# Altium project STM32F373BluePill.PrjPcb (part 4 of 4)
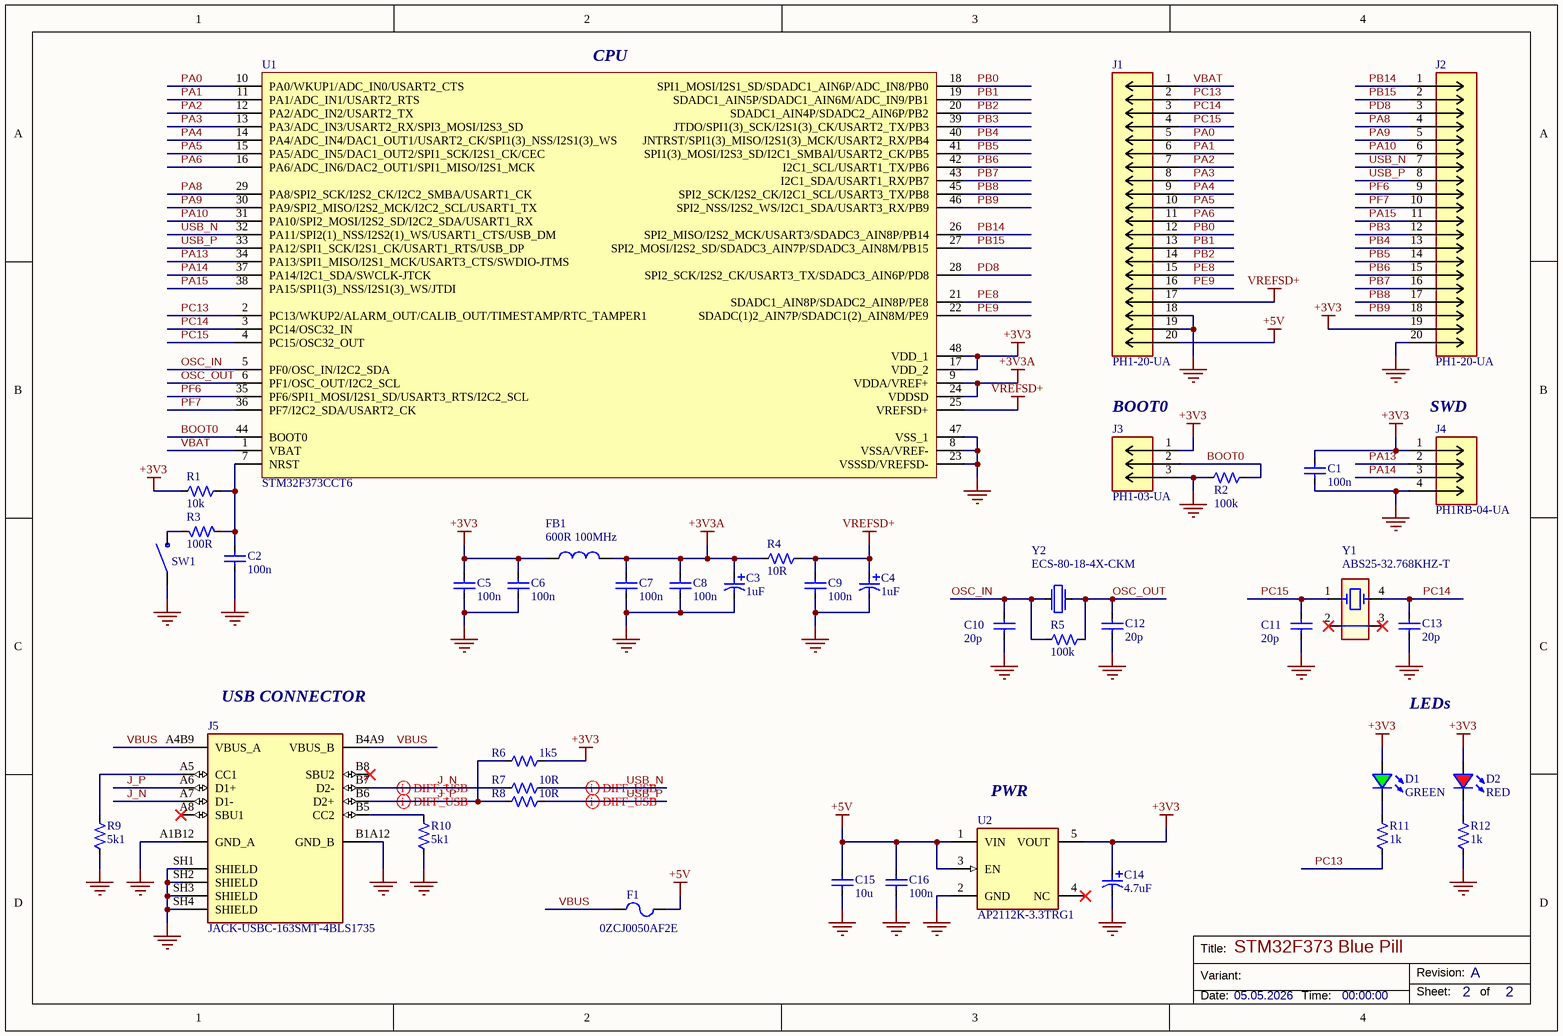
[diagram p4: [02]-STM32F373BluePill.SchDoc]

## Sheet [02]-STM32F373BluePill.SchDoc (continued)

### Library data of the parts (continued)
Y1 = Y_ABS25-32.768KHZ-T: Crystal, Plastic Molded 32.768Khz, 12.5F, 20Ppm-40+85C, 8 X 4 X 2.5 Rohs Compliant: Yes; Manufacturer 1: Abracon; ESR (Equivalent Series Resistance): 50kΩ; Frequency Stability: 122ppm; Frequency Tolerance: 0.002%; Load Capacitance: 12.5pF; Supplier 1: DigiKey; Manufacturer Part Number 1: ABS25-32.768KHZ-T; Stock 1: 218336; Pricing 1: 1=0.47, 10=0.411, 25=0.3892, 50=0.373, 100=0.3576, 250=0.33816, 500=0.32418, 1000=0.31077 (USD); RoHS: Compliant; Case/Package: SMD/SMT; China RoHS: Non-Compliant; Country of Origin: Japan; Depth: 3.8mm; Export Control Classification Number (ECCN) Code: EAR99; Frequency: 32.768kHz; Height: 2.4892mm; Harmonized Tariff Schedule (HTS) Code: 8541.60.00.10; Introduction Date: 2011-06-01; Lead Free: Lead Free; Length: 8mm; Lifecycle Status: Production; Max Operating Temperature: 85°C; Min Operating Temperature: -40°C; Mount: Surface Mount; Number of Pins: 4; Packaging: Cut Tape; Radiation Hardening: No; REACH SVHC: No; Schedule B: 8541600025, 8541600025|8541600025|8541600025|8541600025|8541600025|8541600025|8541600025|8541600025|8541600025, 8541600025|8541600025|8541600025|8541600025|8541600025|8541600025|8541600025|8541600025|8541600025|8541600025, 8541600025|8541600025|8541600025|8541600025|8541600025|8541600025|8541600025|8541600025|8541600025|8541600025|8541600025; Series Resistance: 50kΩ; Termination: SMD/SMT; Tolerance: 0.002%; Width: 3.81mm; ComponentLink1URL: https://datasheet.octopart.com:443/ABS25-32.768KHZ-T-Abracon-datasheet-166807298.pdf?src-supplier=JRH+Electronics; ComponentLink1Description: https://datasheet.octopart.com:443/ABS25-32.768KHZ-T-Abracon-datasheet-166807298.pdf?src-supplier=JRH+Electronics; ComponentLink2URL: https://datasheet.octopart.com:443/ABS25-32.768KHZ-T-Abracon-datasheet-103055944.pdf?src-supplier=JRH+Electronics; ComponentLink2Description: https://datasheet.octopart.com:443/ABS25-32.768KHZ-T-Abracon-datasheet-103055944.pdf?src-supplier=JRH+Electronics; ComponentLink3URL: https://datasheet.octopart.com:443/ABS25-32.768KHZ-T-Abracon-datasheet-181954792.pdf?src-supplier=IHS; ComponentLink3Description: https://datasheet.octopart.com:443/ABS25-32.768KHZ-T-Abracon-datasheet-181954792.pdf?src-supplier=IHS; ComponentLink4URL: https://datasheet.octopart.com:443/ABS25-32.768KHZ-T-Abracon-datasheet-11036012.pdf?src-supplier=Sager+Electronics; ComponentLink4Description: https://datasheet.octopart.com:443/ABS25-32.768KHZ-T-Abracon-datasheet-11036012.pdf?src-supplier=Sager+Electronics; ComponentLink5URL: https://datasheet.octopart.com:443/ABS25-32.768KHZ-T-Abracon-datasheet-8792182.pdf?src-supplier=Sager+Electronics; ComponentLink5Description: https://datasheet.octopart.com:443/ABS25-32.768KHZ-T-Abracon-datasheet-8792182.pdf?src-supplier=Sager+Electronics; ComponentLink6URL: https://datasheet.octopart.com:443/ABS25-32.768KHZ-T-Abracon-datasheet-8332207.pdf?src-supplier=Sager+Electronics; ComponentLink6Description: https://datasheet.octopart.com:443/ABS25-32.768KHZ-T-Abracon-datasheet-8332207.pdf?src-supplier=Sager+Electronics; ComponentLink7URL: https://datasheet.octopart.com:443/ABS25-32.768KHZ-T-Abracon-datasheet-32780516.pdf?src-supplier=Newark; ComponentLink7Description: https://datasheet.octopart.com:443/ABS25-32.768KHZ-T-Abracon-datasheet-32780516.pdf?src-supplier=Newark; ComponentLink8URL: https://datasheet.octopart.com:443/ABS25-32.768KHZ-T-Abracon-datasheet-15206622.pdf?src-supplier=TME; ComponentLink8Description: https://datasheet.octopart.com:443/ABS25-32.768KHZ-T-Abracon-datasheet-15206622.pdf?src-supplier=TME; ComponentLink9URL: https://datasheet.octopart.com:443/ABS25-32.768KHZ-T-Abracon-datasheet-7875.pdf?src-supplier=DigiKey; ComponentLink9Description: https://datasheet.octopart.com:443/ABS25-32.768KHZ-T-Abracon-datasheet-7875.pdf?src-supplier=DigiKey; ComponentLink10URL: https://datasheet.octopart.com:443/ABS25-32.768KHZ-T-Abracon-datasheet-164982.pdf?src-supplier=Mouser; ComponentLink10Description: https://datasheet.octopart.com:443/ABS25-32.768KHZ-T-Abracon-datasheet-164982.pdf?src-supplier=Mouser; ComponentLink11URL: https://datasheet.octopart.com:443/ABS25-32.768KHZ-T-Abracon-datasheet-72903.pdf?src-supplier=RS+(Formerly+Allied+Electronics); ComponentLink11Description: https://datasheet.octopart.com:443/ABS25-32.768KHZ-T-Abracon-datasheet-72903.pdf?src-supplier=RS+(Formerly+Allied+Electronics); ComponentLink12URL: https://datasheet.octopart.com:443/ABS25-32.768KHZ-T-Abracon-datasheet-3537.pdf?src-supplier=Farnell; ComponentLink12Description: https://datasheet.octopart.com:443/ABS25-32.768KHZ-T-Abracon-datasheet-3537.pdf?src-supplier=Farnell; ComponentLink13URL: http://sigma.octopart.com:80/conflict_mineral_statement/Abracon-company-27.pdf?src-supplier=Compliance+Statements; ComponentLink13Description: http://sigma.octopart.com:80/conflict_mineral_statement/Abracon-company-27.pdf?src-supplier=Compliance+Statements; Supplier Part Number 1: 535-9166-1-ND
Y2 = Y_ECS-80-18-4X-CKM: 8 MHz ±10ppm Crystal 18pF 80 Ohms HC-49/US; Manufacturer 1: ECS International; Supplier 1: DigiKey; Manufacturer Part Number 1: ECS-80-18-4X-CKM; Stock 1: 5547; Pricing 1: 1=0.48, 10=0.421, 25=0.398, 50=0.3814, 200=0.3505, 400=0.336, 600=0.3278, 1000=0.31775, 2600=0.29978 (USD); RoHS: Compliant; Schedule B: 8541600025, 8541600025|8541600025, 8541600025|8541600025|8541600025, 8541600025|8541600025|8541600025|8541600025; ComponentLink1URL: https://datasheet.octopart.com:443/ECS-80-18-4X-CKM-ECS-International-datasheet-145012648.pdf?src-supplier=Electro+Sonic; ComponentLink1Description: https://datasheet.octopart.com:443/ECS-80-18-4X-CKM-ECS-International-datasheet-145012648.pdf?src-supplier=Electro+Sonic; ComponentLink2URL: https://datasheet.octopart.com:443/ECS-80-18-4X-CKM-ECS-International-datasheet-17018834.pdf?src-supplier=Master+Electronics; ComponentLink2Description: https://datasheet.octopart.com:443/ECS-80-18-4X-CKM-ECS-International-datasheet-17018834.pdf?src-supplier=Master+Electronics; Supplier Part Number 1: 50-ECS-80-18-4X-CKM-ND; Case/Package: HC-49/US